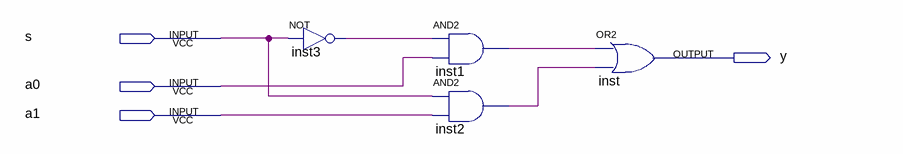
[diagram p0: schematic sheet]
// Quartus schematic mux21.bdf as structural Verilog: 4 symbols, 4 pins
module mux21 (
  input  s,
  input  a0,
  input  a1,
  output y
);

  wire inst1_out, inst2_out, inst3_out;

  not inst3 (inst3_out, s);
  and inst1 (inst1_out, inst3_out, a0);
  and inst2 (inst2_out, s, a1);
  or inst (y, inst1_out, inst2_out);
endmodule
